# Altium schematic sheet Sheet1.SchDoc
size A4; SheetNumber: 1; SheetTotal: 1
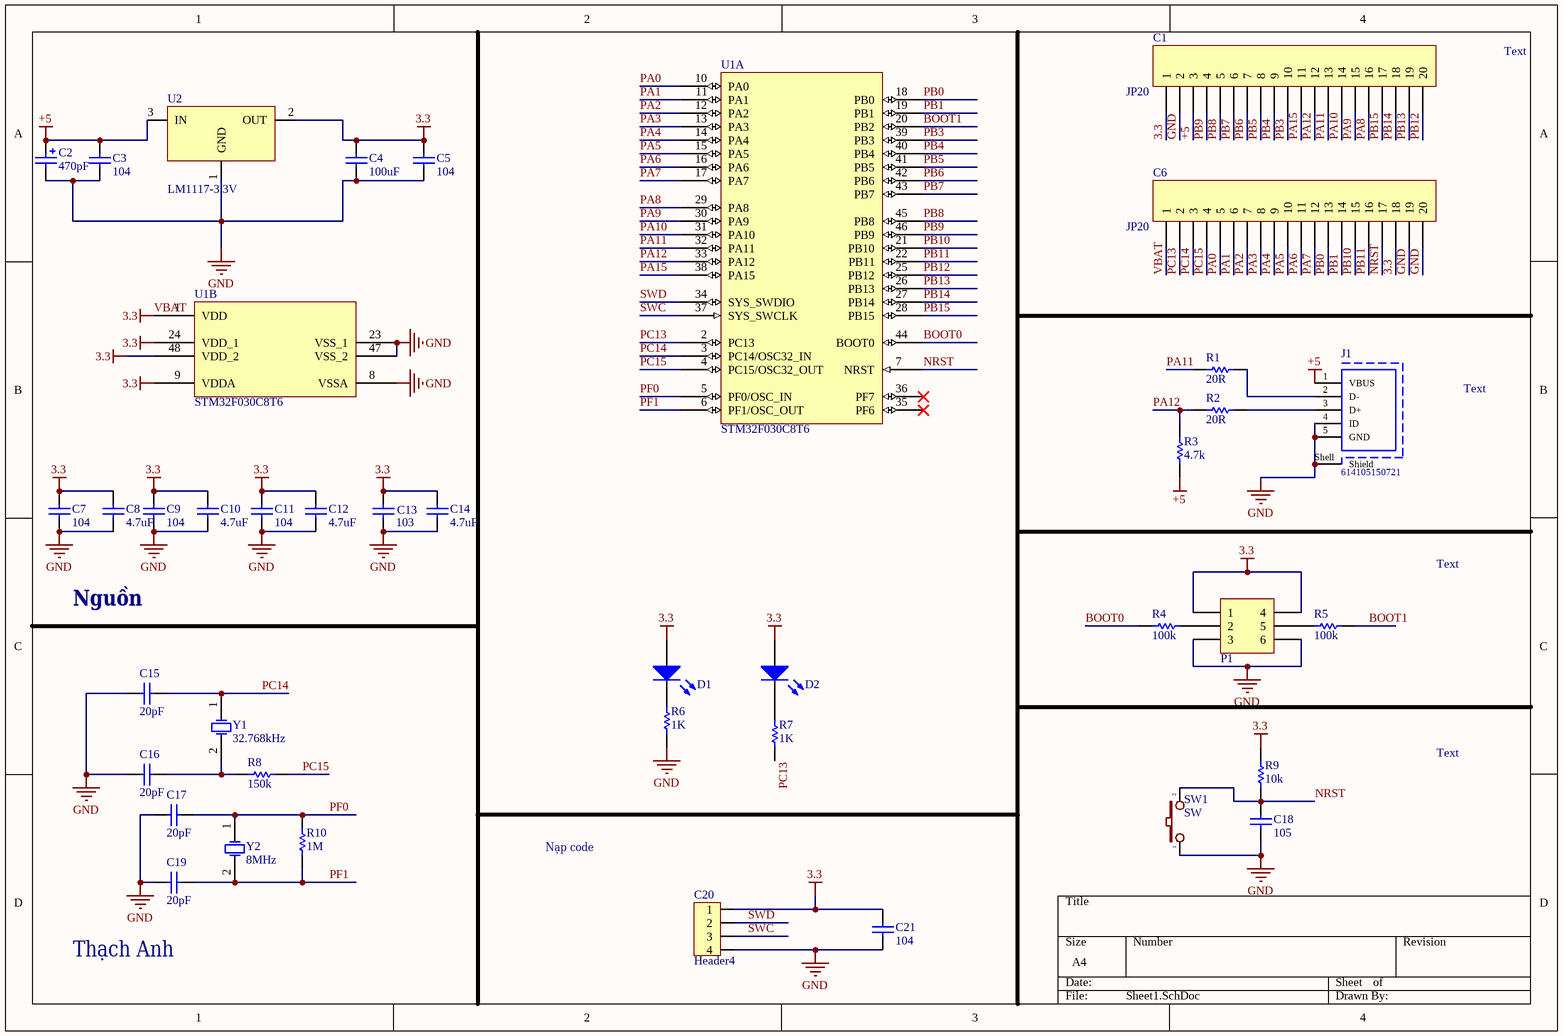
[diagram p0: Sheet1.SchDoc]

## Parts
C1  JP20  [JP20-C1T]
C2  value 470pF  [CAP ALU SIZE B]  (hidden comment: Cap Pol SMD)
C3  value 104  [CAP-SM-0603]  (hidden comment: Cap Non-Pol SMD)
C4  value 100uF  [CAP-SM-0603]  (hidden comment: Cap Non-Pol SMD)
C5  value 104  [CAP-SM-0603]  (hidden comment: Cap Non-Pol SMD)
C6  JP20  [JP20-C1T]
C7  value 104  [CAP-SM-0603]  (hidden comment: Cap Non-Pol SMD)
C8  value 4.7uF  [CAP-SM-0603]  (hidden comment: Cap Non-Pol SMD)
C9  value 104  [CAP-SM-0603]  (hidden comment: Cap Non-Pol SMD)
C10  value 4.7uF  [CAP-SM-0603]  (hidden comment: Cap Non-Pol SMD)
C11  value 104  [CAP-SM-0603]  (hidden comment: Cap Non-Pol SMD)
C12  value 4.7uF  [CAP-SM-0603]  (hidden comment: Cap Non-Pol SMD)
C13  value 103  [CAP-SM-0603]  (hidden comment: Cap Non-Pol SMD)
C14  value 4.7uF  [CAP-SM-0603]  (hidden comment: Cap Non-Pol SMD)
C15  value 20pF  [CAP-SM-0603]  (hidden comment: Cap Non-Pol SMD)
C16  value 20pF  [CAP-SM-0603]  (hidden comment: Cap Non-Pol SMD)
C17  value 20pF  [CAP-SM-0603]  (hidden comment: Cap Non-Pol SMD)
C18  value 105  [CAP-SM-0603]  (hidden comment: Cap Non-Pol SMD)
C19  value 20pF  [CAP-SM-0603]  (hidden comment: Cap Non-Pol SMD)
C20  Header4  [HDR4]
C21  value 104  [CAP-SM-0603]  (hidden comment: Cap Non-Pol SMD)
D1  LED SMD  [LED_0805_Blue]  (value not drawn)
D2  LED SMD  [LED_0805_Blue]  (value not drawn)
J1  614105150721  [614105150721]
P1  Header 3X2  [JP3x2]  (value not drawn)
R1  value 20R  [RES-SM-0603]  (hidden comment: RESISTOR SMD)
R2  value 20R  [RES-SM-0603]  (hidden comment: RESISTOR SMD)
R3  value 4.7k  [RES-SM-0603]  (hidden comment: RESISTOR SMD)
R4  value 100k  [RES-SM-0603]  (hidden comment: RESISTOR SMD)
R5  value 100k  [RES-SM-0603]  (hidden comment: RESISTOR SMD)
R6  value 1K  [RES-SM-0603]  (hidden comment: RESISTOR SMD)
R7  value 1K  [RES-SM-0603]  (hidden comment: RESISTOR SMD)
R8  value 150k  [RES-SM-0603]  (hidden comment: RESISTOR SMD)
R9  value 10k  [RES-SM-0603]  (hidden comment: RESISTOR SMD)
R10  value 1M  [RES-SM-0603]  (hidden comment: RESISTOR SMD)
SW1  SW  [SW1-SMD]
U1  STM32F030C8T6  [STM32F030C8T6]  (parts A,B of 2)
U2  LM1117-3.3V  [SOT223]
Y1  32.768kHz  [WE-XTAL_CFPX-217]
Y2  8MHz  [WE-XTAL_HC49/4HSMX]

## Nets
3.3: C1.1 C4.1 C5.1 C6.1 C6.18 C7.2 C8.2 C9.2 C10.2 C11.2 C12.2 C13.2 C14.2 C20.1 C21.2 D1.1(A) D2.1(A) P1.1 P1.4 R9.1 U1.1(VDD) U1.9(VDDA) U1.24(VDD_1) U1.48(VDD_2) U2.2(OUT)  [also labelled VBAT]
+5: C1.3 C2.1 C3.1 J1.1(VBUS) R3.2 U2.3(IN)
GND: C1.2 C2.2 C3.2 C4.2 C5.2 C6.19 C6.20 C7.1 C8.1 C9.1 C10.1 C11.1 C12.1 C13.1 C14.1 C15.2 C16.2 C17.2 C18.1 C19.2 C20.4 C21.1 J1.4(ID) J1.5(GND) J1.Shell(Shield) P1.3 P1.6 R6.1 SW1.1 U1.8(VSSA) U1.23(VSS_1) U1.47(VSS_2) U2.1(GND)
BOOT0: R4.2 U1.44(BOOT0)
BOOT1: R5.1 U1.20(PB2)
NRST: C6.17 C18.2 R9.2 SW1.2 U1.7(NRST)
PA0: C6.5 U1.10(PA0)
PA1: C6.6 U1.11(PA1)
PA2: C6.7 U1.12(PA2)
PA3: C6.8 U1.13(PA3)
PA4: C6.9 U1.14(PA4)
PA5: C6.10 U1.15(PA5)
PA6: C6.11 U1.16(PA6)
PA7: C6.12 U1.17(PA7)
PA8: C1.16 U1.29(PA8)
PA9: C1.15 U1.30(PA9)
PA10: C1.14 U1.31(PA10)
PA11: C1.13 R1.2 U1.32(PA11)
PA12: C1.12 R2.2 R3.1 U1.33(PA12)
PA15: C1.11 U1.38(PA15)
PB0: C6.13 U1.18(PB0)
PB1: C6.14 U1.19(PB1)
PB3: C1.10 U1.39(PB3)
PB4: C1.9 U1.40(PB4)
PB5: C1.8 U1.41(PB5)
PB6: C1.7 U1.42(PB6)
PB7: C1.6 U1.43(PB7)
PB8: C1.5 U1.45(PB8)
PB9: C1.4 U1.46(PB9)
PB10: C6.15 U1.21(PB10)
PB11: C6.16 U1.22(PB11)
PB12: C1.20 U1.25(PB12)
PB13: C1.19 U1.26(PB13)
PB14: C1.18 U1.27(PB14)
PB15: C1.17 U1.28(PB15)
PC13: C6.2 R7.1 U1.2(PC13)
PC14: C6.3 C15.1 U1.3(PC14/OSC32_IN) Y1.1(OSC1)
PC15: C6.4 R8.1 U1.4(PC15/OSC32_OUT)
PF0: C17.1 R10.2 U1.5(PF0/OSC_IN) Y2.1(OSC1)
PF1: C19.1 R10.1 U1.6(PF1/OSC_OUT) Y2.2(OSC2)
SWC: C20.3 U1.37(SYS_SWCLK)
SWD: C20.2 U1.34(SYS_SWDIO)
NetC16_1: C16.1 R8.2 Y1.2(OSC2)
NetD2_2: D2.2(K) R7.2
NetJ1_2: J1.2(D-) R1.1
NetJ1_3: J1.3(D+) R2.1
NetP1_2: P1.2 R4.1
NetP1_5: P1.5 R5.2

Not connected (* = marked no-connect by the designer): D1 2(K); R6 2; U1 35(PF6)* 36(PF7)*

## Notes on the sheet
- Text
- Nguồn
- Nạp code
- Thạch Anh

## Library data of the parts
C1 C6 = JP20: WR-PHD 2.54 mm Angled Socket Header; Manufacturer: W¨¹rth Elektronik eiSos GmbH; partNo: 613020143121; ComponentLink1 Description: Manufacturer; ComponentLink2 Description: Datasheet; NoPins: 20; Created Date: 29 March 2013; ComponentLink1URL: http://www.we-online.com; ComponentLink2URL: http://katalog.we-online.de/em/datasheet/6130xx143121.pdf; Created by: Karrer Zheng
C2 = Cap Pol SMD: Polarized Capacitor (Radial)
C3-C5 C7-C19 C21 = Cap Non-Pol SMD: Capacitor
C20 = Header4: Header IDC, 4 x 1 Pin Vertical 2.54mm Pitch (Non-Boxed, Male); Manufacturer: W¨¹rth Elektronik eiSos GmbH; partNo: 613002143121; ComponentLink1 Description: Manufacturer; ComponentLink2 Description: Datasheet; NoPins: 02; Created Date: 29 March 2013; ComponentLink1URL: http://www.we-online.com; ComponentLink2URL: http://katalog.we-online.de/em/datasheet/6130xx143121.pdf; Created by: Karrer Zheng
D1 D2 = LED SMD: LED
J1 = 614105150721: Micro USB 2.0 Type B Receptacle WR-COM, Vertical, THT; Rated Current: 1.8 A; Contact Resistance: 30 mOhm; Working Voltage: 30 VAC; ComponentLink1Description: Manufacturer; ComponentLink1URL: http://www.we-online.de; ComponentLink2Description: Datasheet; ComponentLink2URL: https://katalog.we-online.de/em/datasheet/614105150721.pdf; Part Number: 614105150721; Published Date: September 2018; Publisher: Wurth Elektronik; Orientation: Vertical; Connector Type: Micro USB 2.0 Type B; Operating Temperature: -40 to 85 degC; Mounting Technology: THT; Gender: Receptacle; Packaging: Tape and Reel
P1 = Header 3X2: Header, 3-Pin, Dual row; LatestRevisionDate: 17-Jul-2002; LatestRevisionNote: Re-released for DXP Platform.; Publisher: Altium Limited
R1-R10 = RESISTOR SMD: Resistor
SW1 = SW2: Switch button 2 pin; Value: SW chip 2 pin
U1 = STM32F030C8T6: ARM® Cortex®-M0 series Microcontroller IC 32-Bit Single-Core 48MHz 64KB (64K x 8) FLASH 48-LQFP (7x7); Mfr: STMicroelectronics; Connectivity: I²C, SPI, UART/USART; Peripherals: DMA, POR, PWM, WDT; Number of I/O: 39; RAM Size: 8K x 8; Voltage - Supply (Vcc/Vdd): 2.4V ~ 3.6V; Data Converters: A/D 12x12b; Oscillator Type: Internal; Core Processor: ARM® Cortex®-M0; Core Size: 32-Bit Single-Core; Speed: 48MHz; Program Memory Size: 64KB (64K x 8); Program Memory Type: FLASH; Operating Temperature: -40°C ~ 85°C (TA); Mounting Type: Surface Mount; Supplier Device Package: 48-LQFP (7x7); ComponentLink1Description: Digikey; ComponentLink1URL: https://www.digikey.com/en/products/detail/stmicroelectronics/STM32F030C8T6/4357252
U2 = LM1117: 800mA Low-Dropout Linear Regulator; Creator: Nguyen Ba Bien; Website: http://group3i.net
Y1 = 830009706: WE-XTAL Watch Crystal, SMT, CFPX-217, 32.768kHz, +/-20ppm; Manufacturer: Wurth Elektronik; Load Capacitance: 9pF; ComponentLink1Description: Manufacturer; ComponentLink1URL: http://www.we-online.de; ComponentLink2Description: Datasheet; ComponentLink2URL: https://katalog.we-online.com/pbs/datasheet/830009706.pdf; Operating Temperature: -40 to +85degC; Packaging: Tape and Reel; Manufacturer Part Number: 830009706; Published Date: July 2020; Size: CFPX-217; Frequency Stability: -; Frequency: 32.768kHz; Frequency Tolerance: +/-20ppm; Mounting Technology: SMT
Y2 = 830003151: WE-XTAL Quartz Crystal, SMT, HC49/4HSMX, 8MHz, +/-30ppm; Manufacturer: Wurth Elektronik; Frequency Stability: +/-50ppm; Load Capacitance: 16pF; ComponentLink1Description: Manufacturer; ComponentLink1URL: http://www.we-online.de; ComponentLink2Description: Datasheet; ComponentLink2URL: https://katalog.we-online.com/pbs/datasheet/830003151.pdf; Operating Temperature: -10 to +60degC; Packaging: Tape and Reel; Manufacturer Part Number: 830003151; Published Date: July 2020; Size: HC49/4HSMX; Frequency: 8MHz; Frequency Tolerance: +/-30ppm; Mounting Technology: SMT